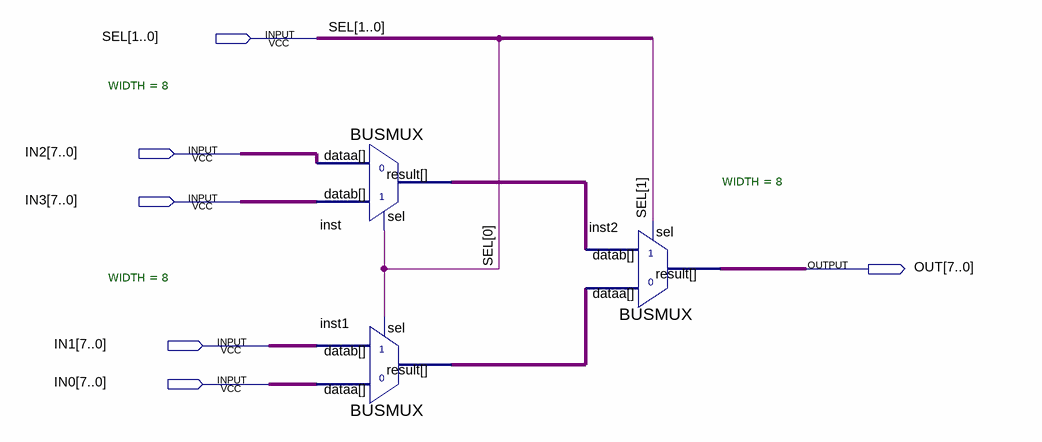
[diagram p0: schematic sheet]
// Quartus schematic 4Mux1.bdf as structural Verilog: 3 symbols, 6 pins
module \4Mux1  (
  input  [1:0] SEL,
  input  [7:0] IN2,
  input  [7:0] IN3,
  input  [7:0] IN1,
  input  [7:0] IN0,
  output [7:0] OUT
);

  wire [7:0] inst1_result, inst_result;

  BUSMUX #(.WIDTH(8)) inst (.datab(IN3), .sel(SEL[0]), .dataa(IN2), .result(inst_result));
  BUSMUX #(.WIDTH(8)) inst1 (.datab(IN1), .sel(SEL[0]), .dataa(IN0), .result(inst1_result));
  BUSMUX #(.WIDTH(8)) inst2 (.datab(inst_result), .sel(SEL[1]), .dataa(inst1_result), .result(OUT));
endmodule
